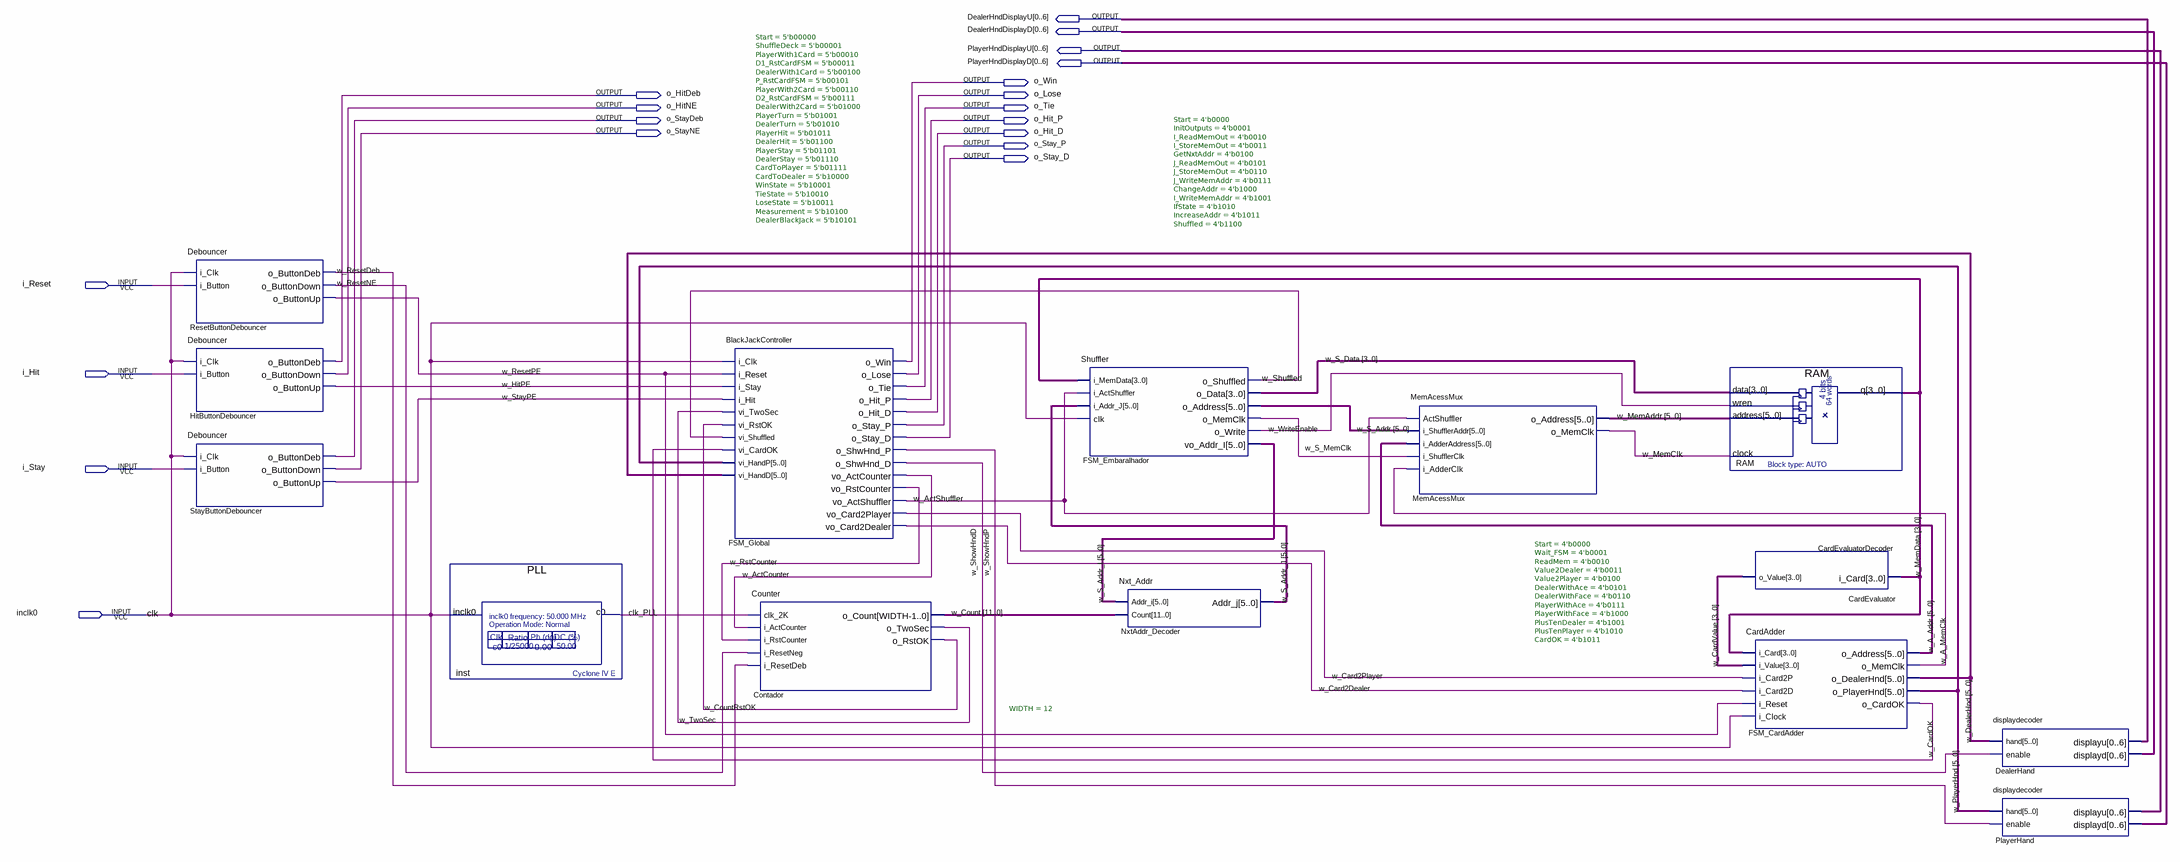
[diagram p0: schematic sheet]
// Quartus schematic BlackJack.bdf as structural Verilog: 14 symbols, 19 pins
module BlackJack (
  input  i_Reset,
  input  i_Hit,
  input  i_Stay,
  input  inclk0,
  output [0:6] DealerHndDisplayU,
  output [0:6] DealerHndDisplayD,
  output [0:6] PlayerHndDisplayU,
  output [0:6] PlayerHndDisplayD,
  output o_Win,
  output o_HitDeb,
  output o_Lose,
  output o_HitNE,
  output o_Tie,
  output o_StayDeb,
  output o_Hit_P,
  output o_StayNE,
  output o_Hit_D,
  output o_Stay_P,
  output o_Stay_D
);

  wire clk_PLL, w_A_MemClk, w_ActCounter, w_ActShuffler, w_Card2Dealer, w_Card2Player, w_CardOK,
       w_CountRstOK, w_HitPE, w_MemClk, w_ResetDeb, w_ResetNE, w_ResetPE, w_RstCounter, w_S_MemClk,
       w_ShowHndD, w_ShowHndP, w_Shuffled, w_StayPE, w_TwoSec, w_WriteEnable;
  wire [3:0] w_CardValue, w_MemData, w_S_Data;
  wire [5:0] w_A_Addr, w_DealerHnd, w_MemAddr, w_PlayerHnd, w_S_Addr, w_S_Addr_I, w_S_Addr_J;
  wire [11:0] w_Count;

  Debouncer ResetButtonDebouncer (
    .i_Clk(inclk0), .i_Button(i_Reset), .o_ButtonDeb(w_ResetDeb), .o_ButtonDown(w_ResetNE),
    .o_ButtonUp(w_ResetPE));
  Debouncer HitButtonDebouncer (
    .i_Clk(inclk0), .i_Button(i_Hit), .o_ButtonDeb(o_HitDeb), .o_ButtonDown(o_HitNE), .o_ButtonUp(w_HitPE));
  Debouncer StayButtonDebouncer (
    .i_Clk(inclk0), .i_Button(i_Stay), .o_ButtonDeb(o_StayDeb), .o_ButtonDown(o_StayNE), .o_ButtonUp(w_StayPE));
  PLL inst (.inclk0(inclk0), .c0(clk_PLL));
  BlackJackController #(.Start(5'b00000), .ShuffleDeck(5'b00001), .PlayerWith1Card(5'b00010), .D1_RstCardFSM(5'b00011), .DealerWith1Card(5'b00100), .P_RstCardFSM(5'b00101), .PlayerWith2Card(5'b00110), .D2_RstCardFSM(5'b00111), .DealerWith2Card(5'b01000), .PlayerTurn(5'b01001), .DealerTurn(5'b01010), .PlayerHit(5'b01011), .DealerHit(5'b01100), .PlayerStay(5'b01101), .DealerStay(5'b01110), .CardToPlayer(5'b01111), .CardToDealer(5'b10000), .WinState(5'b10001), .TieState(5'b10010), .LoseState(5'b10011), .Measurement(5'b10100), .DealerBlackJack(5'b10101)) FSM_Global (
    .i_Clk(inclk0), .i_Reset(w_ResetPE), .i_Stay(w_HitPE), .i_Hit(w_StayPE), .vi_TwoSec(w_TwoSec),
    .vi_RstOK(w_CountRstOK), .vi_Shuffled(w_Shuffled), .vi_CardOK(w_CardOK), .vi_HandP(w_PlayerHnd),
    .vi_HandD(w_DealerHnd), .o_Win(o_Win), .o_Lose(o_Lose), .o_Tie(o_Tie), .o_Hit_P(o_Hit_P),
    .o_Hit_D(o_Hit_D), .o_Stay_P(o_Stay_P), .o_Stay_D(o_Stay_D), .o_ShwHnd_P(w_ShowHndP),
    .o_ShwHnd_D(w_ShowHndD), .vo_ActCounter(w_ActCounter), .vo_RstCounter(w_RstCounter),
    .vo_ActShuffler(w_ActShuffler), .vo_Card2Player(w_Card2Player), .vo_Card2Dealer(w_Card2Dealer));
  Counter #(.WIDTH(12)) Contador (
    .clk_2K(clk_PLL), .i_ActCounter(w_ActCounter), .i_RstCounter(w_RstCounter), .i_ResetNeg(w_ResetNE),
    .i_ResetDeb(w_ResetDeb), .o_Count(w_Count), .o_TwoSec(w_TwoSec), .o_RstOK(w_CountRstOK));
  Shuffler #(.Start(4'b0000), .InitOutputs(4'b0001), .I_ReadMemOut(4'b0010), .I_StoreMemOut(4'b0011), .GetNxtAddr(4'b0100), .J_ReadMemOut(4'b0101), .J_StoreMemOut(4'b0110), .J_WriteMemAddr(4'b0111), .ChangeAddr(4'b1000), .I_WriteMemAddr(4'b1001), .IfState(4'b1010), .IncreaseAddr(4'b1011), .Shuffled(4'b1100)) FSM_Embaralhador (
    .i_MemData(w_MemData), .i_ActShuffler(w_ActShuffler), .i_Addr_J(w_S_Addr_J), .clk(inclk0),
    .o_Shuffled(w_Shuffled), .o_Data(w_S_Data), .o_Address(w_S_Addr), .o_MemClk(w_S_MemClk),
    .o_Write(w_WriteEnable), .vo_Addr_I(w_S_Addr_I));
  Nxt_Addr NxtAddr_Decoder (.Addr_i(w_S_Addr_I), .Count(w_Count), .Addr_j(w_S_Addr_J));
  MemAcessMux MemAcessMux (
    .ActShuffler(w_ActShuffler), .i_ShufflerAddr(w_S_Addr), .i_AdderAddress(w_A_Addr),
    .i_ShufflerClk(w_S_MemClk), .i_AdderClk(w_A_MemClk), .o_Address(w_MemAddr), .o_MemClk(w_MemClk));
  RAM RAM (.data(w_S_Data), .wren(w_WriteEnable), .address(w_MemAddr), .clock(w_MemClk), .q(w_MemData));
  CardEvaluator CardEvaluatorDecoder (.i_Card(w_MemData), .o_Value(w_CardValue));
  CardAdder #(.Start(4'b0000), .Wait_FSM(4'b0001), .ReadMem(4'b0010), .Value2Dealer(4'b0011), .Value2Player(4'b0100), .DealerWithAce(4'b0101), .DealerWithFace(4'b0110), .PlayerWithAce(4'b0111), .PlayerWithFace(4'b1000), .PlusTenDealer(4'b1001), .PlusTenPlayer(4'b1010), .CardOK(4'b1011)) FSM_CardAdder (
    .i_Card(w_MemData), .i_Value(w_CardValue), .i_Card2P(w_Card2Player), .i_Card2D(w_Card2Dealer),
    .i_Reset(w_ResetPE), .i_Clock(inclk0), .o_Address(w_A_Addr), .o_MemClk(w_A_MemClk),
    .o_DealerHnd(w_DealerHnd), .o_PlayerHnd(w_PlayerHnd), .o_CardOK(w_CardOK));
  displaydecoder DealerHand (
    .hand(w_DealerHnd), .enable(w_ShowHndD), .displayu(DealerHndDisplayU), .displayd(DealerHndDisplayD));
  displaydecoder PlayerHand (
    .hand(w_PlayerHnd), .enable(w_ShowHndP), .displayu(PlayerHndDisplayU), .displayd(PlayerHndDisplayD));

  // Other names for the same wires on the sheet: clk = inclk0
endmodule
